# EAGLE schematic battery-board (EAGLE 6.4)
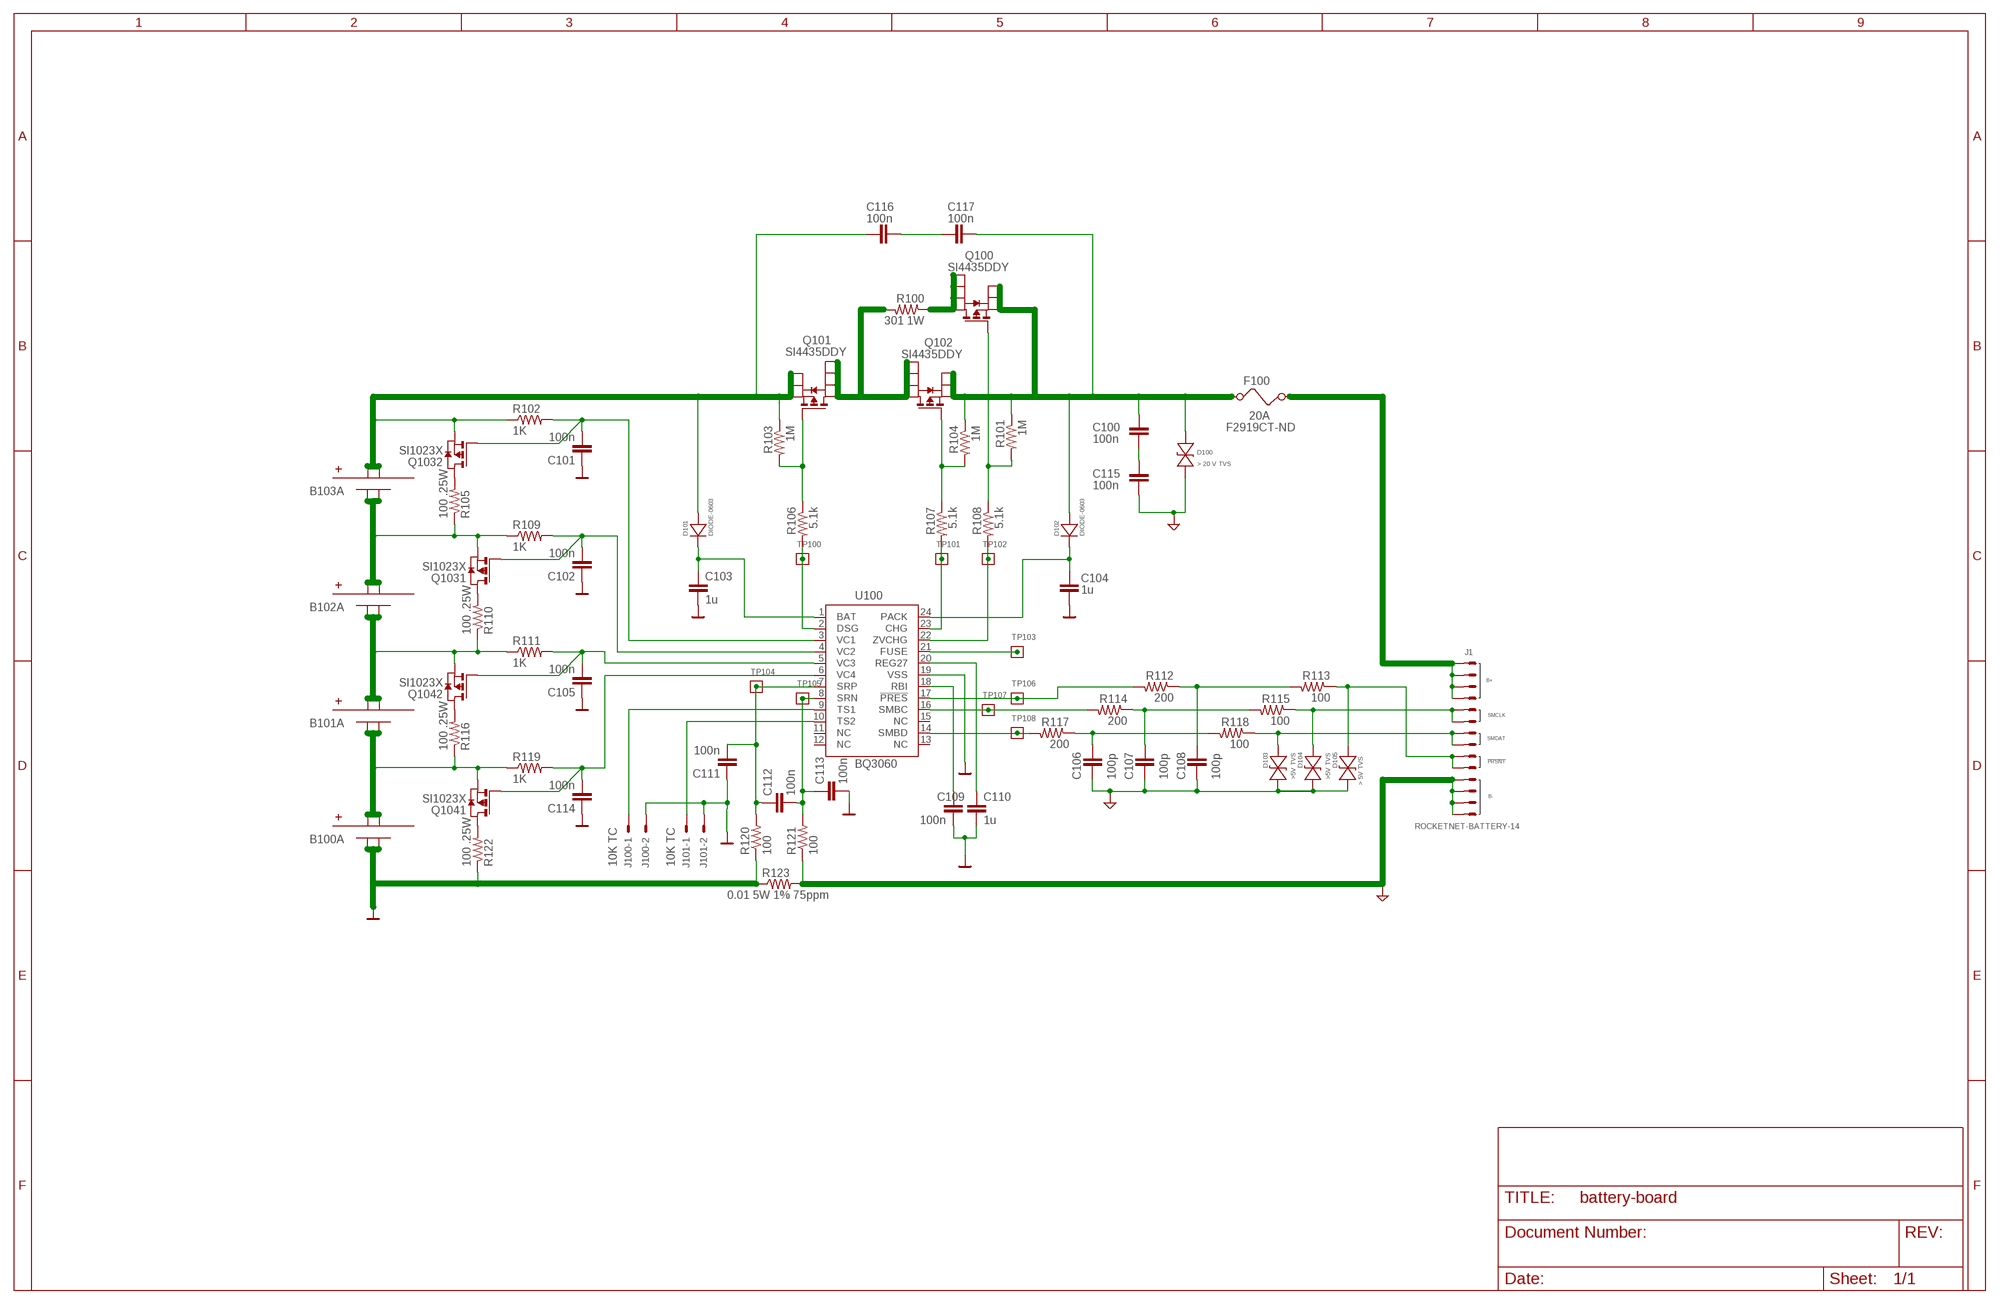
[diagram p0: schematic, sheet 1]

## Parts
B100A  LIPO-8AHR  [LIPO-8AHR-PAC]
B101A  LIPO-8AHR  [LIPO-8AHR-PAC]
B102A  LIPO-8AHR  [LIPO-8AHR-PAC]
B103A  LIPO-8AHR  [LIPO-8AHR-PAC]
C100  100n  C-EU0603-B-NOSILK  [0603-B-NOSILK]
C101  100n  C-EU0402-B-NOSILK  [0402-B-NOSILK]
C102  100n  C-EU0402-B-NOSILK  [0402-B-NOSILK]
C103  1u  C-EU0603-B-NOSILK  [0603-B-NOSILK]
C104  1u  C-EU0603-B-NOSILK  [0603-B-NOSILK]
C105  100n  C-EU0402-B-NOSILK  [0402-B-NOSILK]
C106  100p  C-EU0603-B-NOSILK  [0603-B-NOSILK]
C107  100p  C-EU0603-B-NOSILK  [0603-B-NOSILK]
C108  100p  C-EU0603-B-NOSILK  [0603-B-NOSILK]
C109  100n  C-EU0402-B-NOSILK  [0402-B-NOSILK]
C110  1u  C-EU0603-B-NOSILK  [0603-B-NOSILK]
C111  100n  C-EU0402-B-NOSILK  [0402-B-NOSILK]
C112  100n  C-EU0402-B-NOSILK  [0402-B-NOSILK]
C113  100n  C-EU0402-B-NOSILK  [0402-B-NOSILK]
C114  100n  C-EU0402-B-NOSILK  [0402-B-NOSILK]
C115  100n  C-EU0603-B-NOSILK  [0603-B-NOSILK]
C116  100n  C-EU0603-B-NOSILK  [0603-B-NOSILK]
C117  100n  C-EU0603-B-NOSILK  [0603-B-NOSILK]
D100  > 20 V TVS  TVS-0603  [0603-B-NOSILK-DIODE]
D101  DIODE-0603  [0603-B-NOSILK-DIODE]
D102  DIODE-0603  [0603-B-NOSILK-DIODE]
D103  >5V TVS  TVS-0603  [0603-B-NOSILK-DIODE]
D104  >5V TVS  TVS-0603  [0603-B-NOSILK-DIODE]
D105  > 5V TVS  TVS-0603  [0603-B-NOSILK-DIODE]
F100  20A  FUSE1206  [1206]
J1  ROCKETNET-BATTERY-14  [ROCKETNET-CONNECTOR-M-14]
J100  87758-0216  [87758-0216]
J101  87758-0216  [87758-0216]
Q100  SI4435DDY  [SO-8]
Q101  SI4435DDY  [SO-8]
Q102  SI4435DDY  [SO-8]
Q103  SI1023X  [SOT-563]
Q104  SI1023X  [SOT-563]
R100  301 1W  R-US_1206-B  [1206-B]
R101  1M  R-US_0402-B-NOSILK  [0402-B-NOSILK]
R102  1K  R-US_0402-B-NOSILK  [0402-B-NOSILK]
R103  1M  R-US_0402-B-NOSILK  [0402-B-NOSILK]
R104  1M  R-US_0402-B-NOSILK  [0402-B-NOSILK]
R105  100 .25W  R-US_0603-B-NOSILK  [0603-B-NOSILK]
R106  5.1k  R-US_0402-B-NOSILK  [0402-B-NOSILK]
R107  5.1k  R-US_0402-B-NOSILK  [0402-B-NOSILK]
R108  5.1k  R-US_0402-B-NOSILK  [0402-B-NOSILK]
R109  1K  R-US_0402-B-NOSILK  [0402-B-NOSILK]
R110  100 .25W  R-US_0603-B-NOSILK  [0603-B-NOSILK]
R111  1K  R-US_0402-B-NOSILK  [0402-B-NOSILK]
R112  200  R-US_0603-B-NOSILK  [0603-B-NOSILK]
R113  100  R-US_0603-B-NOSILK  [0603-B-NOSILK]
R114  200  R-US_0603-B-NOSILK  [0603-B-NOSILK]
R115  100  R-US_0603-B-NOSILK  [0603-B-NOSILK]
R116  100 .25W  R-US_0603-B-NOSILK  [0603-B-NOSILK]
R117  200  R-US_0603-B-NOSILK  [0603-B-NOSILK]
R118  100  R-US_0603-B-NOSILK  [0603-B-NOSILK]
R119  1K  R-US_0402-B-NOSILK  [0402-B-NOSILK]
R120  100  R-US_0402-B-NOSILK  [0402-B-NOSILK]
R121  100  R-US_0402-B-NOSILK  [0402-B-NOSILK]
R122  100 .25W  R-US_0603-B-NOSILK  [0603-B-NOSILK]
R123  0.01 5W 1% 75ppm  R-US-2818  [VISHAY-2818]
TP100  TEST-POINT  [2MM-TEST-POINT]
TP101  TEST-POINT  [2MM-TEST-POINT]
TP102  TEST-POINT  [2MM-TEST-POINT]
TP103  TEST-POINT  [2MM-TEST-POINT]
TP104  TEST-POINT  [2MM-TEST-POINT]
TP105  TEST-POINT  [2MM-TEST-POINT]
TP106  TEST-POINT  [2MM-TEST-POINT]
TP107  TEST-POINT  [2MM-TEST-POINT]
TP108  TEST-POINT  [2MM-TEST-POINT]
U100  BQ3060PW  [PW-R-PDSO-G24]

## Nets
B+: B103A.B+@1(B+) B103A.B+@2(B+) C116.1 D101.ANODE Q101.1(S) Q101.2(S) Q101.3(S) Q103.4(2:S) R102.1 R103.1
B+PACKOUT: F100.2 J1.B+@1(B+) J1.B+@2(B+) J1.B+@3(B+) J1.B+@4(B+)
BAR_GND: B100A.B-@1(B-) B100A.B-@2(B-) C101.1 C102.1 C103.2 C104.2 C105.1 C109.2 C110.2 C111.1 C113.2 C114.1 J100.2 J101.2 R120.1 R122.1 R123.P$1 U100.19(VSS) ; supply symbol labelled SUP_GND_BAR
N$1: J100.1 U100.9(TS1)
N$2: J101.1 U100.10(TS2)
N$3: C103.1 D101.CATHODE U100.1(BAT)
N$4: B101A.B+@1(B+) B101A.B+@2(B+) B102A.B-@1(B-) B102A.B-@2(B-) Q104.4(2:S) R110.1 R111.1
N$5: C111.2 C112.1 R120.2 TP104.1 U100.7(SRP)
N$6: C112.2 C113.1 R121.2 TP105.1 U100.8(SRN)
N$7: B100A.B+@1(B+) B100A.B+@2(B+) B101A.B-@1(B-) B101A.B-@2(B-) Q104.1(1:S) R116.1 R119.1
N$8: B102A.B+@1(B+) B102A.B+@2(B+) B103A.B-@1(B-) B103A.B-@2(B-) Q103.1(1:S) R105.1 R109.1
N$9: Q104.3(2:D) R116.2
N$10: C102.2 Q103.2(1:G) R109.2 U100.4(VC2)
N$11: C105.2 Q104.5(2:G) R111.2 U100.5(VC3)
N$12: C114.2 Q104.2(1:G) R119.2 U100.6(VC4)
N$13: C109.1 U100.18(RBI)
N$14: C110.1 U100.20(REG27)
N$15: R117.2 TP108.1 U100.14(SMBD)
N$16: R114.2 TP107.1 U100.16(SMBC)
N$17: C106.1 R117.1 R118.2
N$18: Q104.6(1:D) R122.2
N$19: C101.2 Q103.5(2:G) R102.2 U100.3(VC1)
N$20: Q103.6(1:D) R110.2
N$21: Q103.3(2:D) R105.2
N$22: D103.ANODE J1.SMDAT@7(SMDAT) J1.SMDAT@8(SMDAT) R118.1
N$24: C107.1 R114.1 R115.2
N$25: D104.ANODE J1.SMCLK@3(SMCLK) J1.SMCLK@4(SMCLK) R115.1
N$27: R106.2 TP100.1 U100.2(DSG)
N$28: Q101.5(D) Q101.6(D) Q101.7(D) Q101.8(D) Q102.5(D) Q102.6(D) Q102.7(D) Q102.8(D) R100.2
N$29: R108.2 TP102.1 U100.22(ZVCHG)
N$30: R107.2 TP101.1 U100.23(CHG)
N$31: C104.1 D102.CATHODE U100.24(PACK)
N$33: C108.1 R112.1 R113.2
N$34: Q101.4(G) R103.2 R106.1
N$35: D105.ANODE J1.!PRSNT@9(!PRSNT) J1.!PRSNT@10(!PRSNT) R113.1
N$36: Q102.4(G) R104.2 R107.1
N$37: C100.2 C115.1
N$38: TP103.1 U100.21(FUSE)
N$39: Q100.4(G) R101.2 R108.1
N$40: C116.2 C117.1
N$43: C100.1 C117.2 D100.ANODE D102.ANODE F100.1 Q100.1(S) Q100.2(S) Q100.3(S) Q102.1(S) Q102.2(S) Q102.3(S) R101.1 R104.1
N$45: R112.2 TP106.1 U100.17(!PRES)
PRE-CHARGE: Q100.5(D) Q100.6(D) Q100.7(D) Q100.8(D) R100.1
TRIANGLE_GND: C106.2 C107.2 C108.2 C115.2 D100.CATHODE D103.CATHODE D104.CATHODE D105.CATHODE J1.B-@11(B-) J1.B-@12(B-) J1.B-@13(B-) J1.B-@14(B-) R121.1 R123.P$2 ; supply symbol labelled SUP_GND_TRIANGLE
Unconnected: U100.11(NC) U100.12(NC) U100.13(NC) U100.15(NC)

## Notes on the sheet
- 10K TC | 10K TC

## Library data of the parts
B100A B101A B102A B103A = battery:LIPO-8AHR
C100-C117 = rcl_custom:C-EU: CAPACITOR, European symbol
D100 D103-D105 = tvs-0603:TVS-0603
D101 D102 = diode-0603:DIODE-0603
F100 = psas:FUSE: Fuse; DK: F2919CT-ND
J1 = rocketnet-connector:ROCKETNET-BATTERY-14
J100 J101 = con-molex:87758-0216: 2 Pin - 2mm Dual Row Single Wafer, Vertical T/H HDR Source: http://www.molex.com/pdm_docs/sd/877580616_sd.pdf; MPN: 87758-0216; OC_FARNELL: unknown; OC_NEWARK: 94M1513
Q100-Q102 = si4435ddy:SI4435DDY
Q103 Q104 = si1023x:SI1023X
R100-R122 = rcl_custom:R-US_: RESISTOR, American symbol
R123 = shunt:R-US-2818
TP100-TP108 = Tova:TEST-POINT
U100 = bq3060:BQ3060